# Altium schematic sheet Structure.SchDoc
size A4
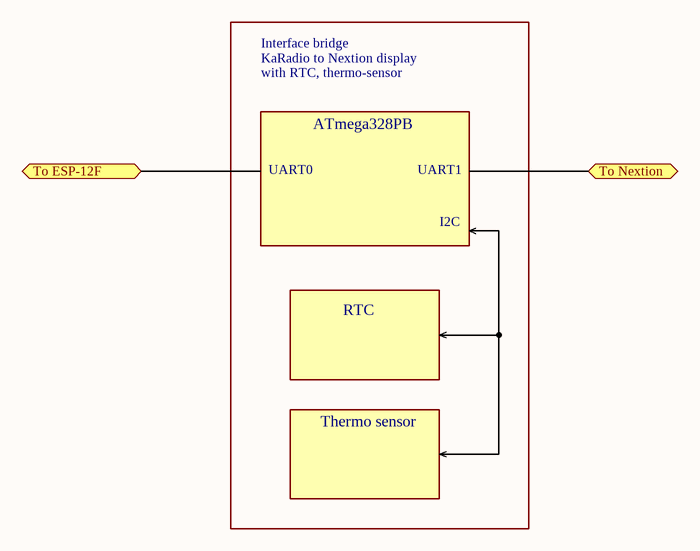
[diagram p0: Structure.SchDoc]

## Ports
To ESP-12F (bidir), To Nextion (bidir)

## Notes on the sheet
- Interface bridge
- KaRadio to Nextion display
- with RTC, thermo-sensor
- UART0
- ATmega328PB
- UART1
- I2C
- RTC
- Thermo sensor